# Altium schematic sheet Control.schdoc: EGB220_ControlBoard
size A3
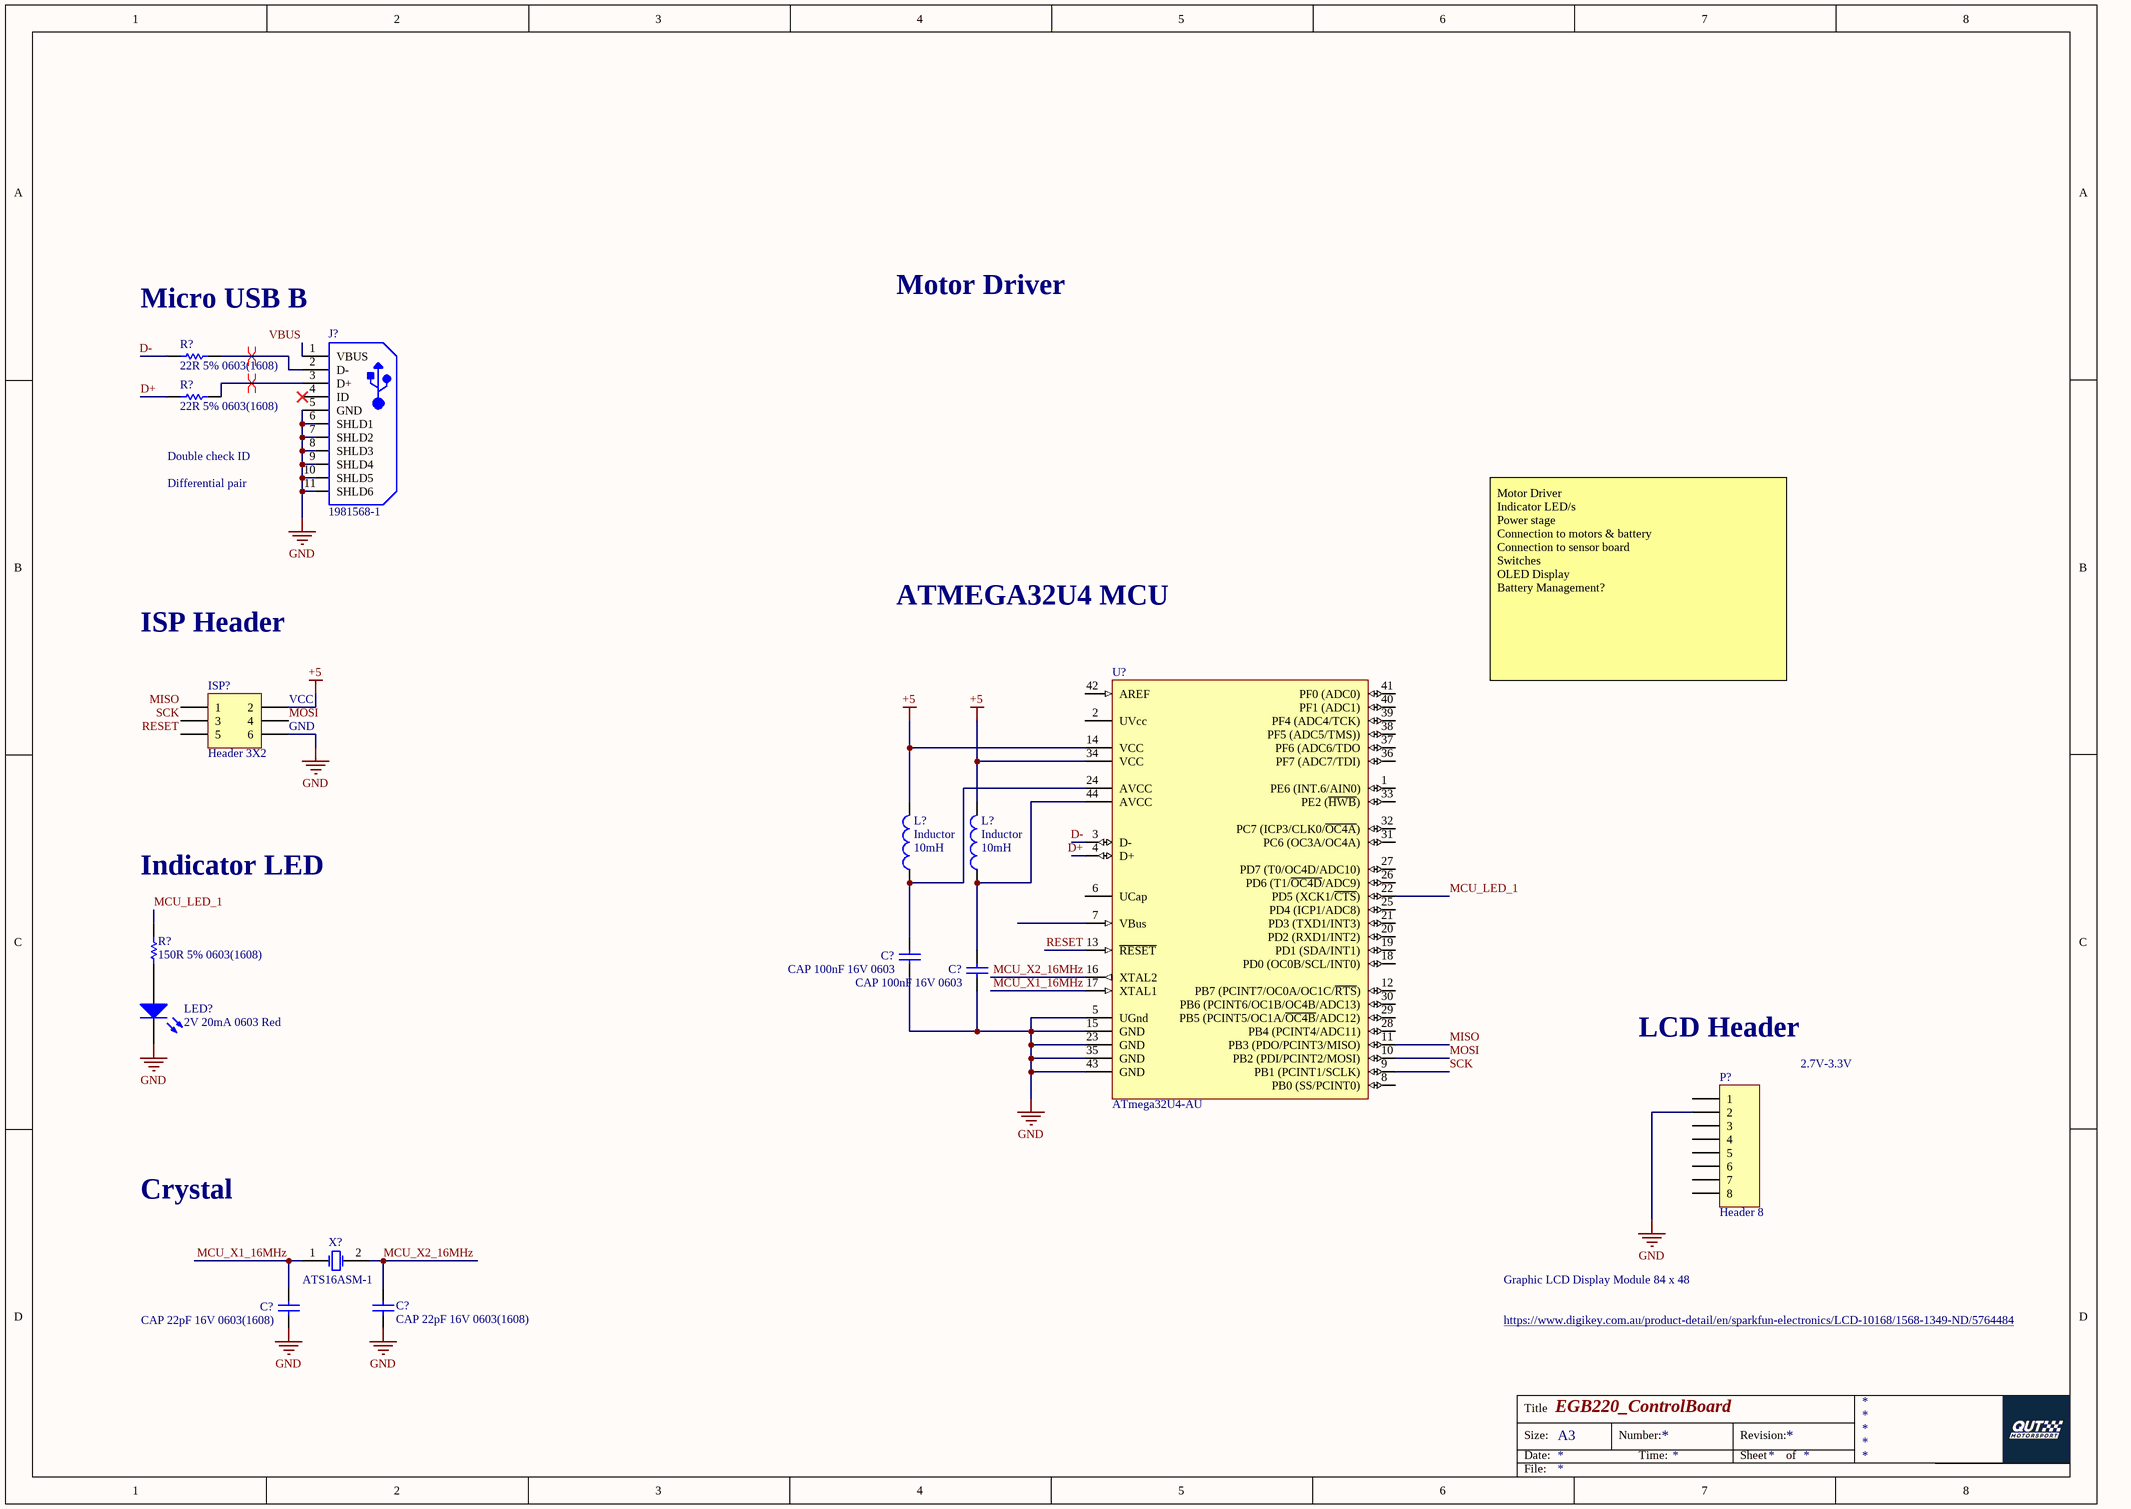
[diagram p0: Control.schdoc]

## Parts
(Parts that share a designator on the sheet are numbered #1, #2 ... from top to bottom, then left to right.)
C?#1  CAP 100nF 16V 0603  [CAPC0603(1608)100_M]
C?#2  CAP 100nF 16V 0603  [CAPC0603(1608)100_M]
C?#3  CAP 22pF 16V 0603(1608)  [CAPC0603(1608)100_N]
C?#4  CAP 22pF 16V 0603(1608)  [CAPC0603(1608)100_N]
ISP?  Header 3X2  [HDR2X3]
J?  1981568-1  [TECO-1981568-5_V]
L?#1  Inductor  value 10mH  [0603]
L?#2  Inductor  value 10mH  [0603]
LED?  2V 20mA 0603 Red  [0603_A]
P?  Header 8  [HDR1X8]
R?#1  22R 5% 0603(1608)  [RESC0603(1608)_N]
R?#2  22R 5% 0603(1608)  [RESC0603(1608)_N]
R?#3  150R 5% 0603(1608)  [RESC0603(1608)_L]
U?  ATmega32U4-AU  [44ML_M]
X?  ATS16ASM-1  [CTS-ATS-SM-XTAL-2]

## Nets
+5: ISP?.2 L?#1.2 L?#2.2 U?.14(VCC) U?.34(VCC)
GND: C?#1.1 C?#2.1 C?#3.2 C?#4.1 ISP?.6 J?.5(GND) J?.6(SHLD1) J?.7(SHLD2) J?.8(SHLD3) J?.9(SHLD4) J?.10(SHLD5) J?.11(SHLD6) LED?.1(K) P?.2 U?.5(UGnd) U?.15(GND) U?.23(GND) U?.35(GND) U?.43(GND)
D+: R?#2.1 U?.4(D+)
D-: R?#1.1 U?.3(D-)
MCU_LED_1: R?#3.2 U?.22(PD5_(XCK1/~{CTS}))
MCU_X1_16MHz: C?#4.2 U?.17(XTAL1) X?.1(X1)
MCU_X2_16MHz: C?#3.1 U?.16(XTAL2) X?.2(X2)
MISO: ISP?.1 U?.11(PB3_(PDO/PCINT3/MISO))
MOSI: ISP?.4 U?.10(PB2_(PDI/PCINT2/MOSI))
RESET: ISP?.5 U?.13(~{RESET})
SCK: ISP?.3 U?.9(PB1_(PCINT1/SCLK))
VBUS: J?.1(VBUS)
NetC?#1_2: C?#1.2 L?#1.1 U?.24(AVCC)
NetC?#2_2: C?#2.2 L?#2.1 U?.44(AVCC)
NetJ?_2: J?.2(D-) R?#1.2
NetJ?_3: J?.3(D+) R?#2.2
NetLED?_2: LED?.2(A) R?#3.1

Not connected (* = marked no-connect by the designer): J? 4(ID)*; P? 1 3 4 5 6 7 8; U? 1(PE6_(INT.6/AIN0)) 2(UVcc) 6(UCap) 7(VBus) 8(PB0_(SS/PCINT0)) 12(PB7_(PCINT7/OC0A/OC1C/~{RTS})) 18(PD0_(OC0B/SCL/INT0)) 19(PD1_(SDA/INT1)) 20(PD2_(RXD1/INT2)) 21(PD3_(TXD1/INT3)) 25(PD4_(ICP1/ADC8)) 26(PD6_(T1/~{OC4D}/ADC9)) 27(PD7_(T0/OC4D/ADC10)) 28(PB4_(PCINT4/ADC11)) 29(PB5_(PCINT5/OC1A/~{OC4B}/ADC12)) 30(PB6_(PCINT6/OC1B/OC4B/ADC13)) 31(PC6_(OC3A/OC4A)) 32(PC7_(ICP3/CLK0/~{OC4A})) 33(PE2_(~{HWB})) 36(PF7_(ADC7/TDI)) 37(PF6_(ADC6/TDO) 38(PF5_(ADC5/TMS))) 39(PF4_(ADC4/TCK)) 40(PF1_(ADC1)) 41(PF0_(ADC0)) 42(AREF)

## Layout directives
differential pair: NetJ?_2, NetJ?_3

## Notes on the sheet
- Micro USB B
- Motor Driver
- Double check ID
- Differential pair
- ISP Header
- ATMEGA32U4 MCU
- (near ISP?) VCC
- Motor Driver
  Indicator LED/s
  Power stage
  Connection to motors & battery
  Connection to sensor board
  Switches
  OLED Display
  Battery Management?
- (near ISP?) GND
- Indicator LED
- LCD Header
- 2.7V-3.3V
- Crystal
- Graphic LCD Display Module 84 x 48
- https://www.digikey.com.au/product-detail/en/sparkfun-electronics/LCD-10168/1568-1349-ND/5764484
- Title
- Size:
- Date:
- A3
- Number:
- Time:
- Revision:
- Sheet
- of
- File:

## Library data of the parts
C?#1 C?#2 = CMP-1035-02583-1: CAP 100nF 16V ±5% 0603 (1608 Metric) Thickness 1mm SMD; Tolerance: Â±5%; Case-Metric: 1608; Case-EIA: 0603; Rated Voltage: 16 V; Max Thickness: 1 mm; Technology: SMT; Value: 100nF
C?#3 C?#4 = CMP-1035-00808-1: CAP 22pF 16V ±5% 0603 (1608 Metric) Thickness 1mm SMD; Tolerance: Â±5%; Case-EIA: 0603; Case-Metric: 1608; Technology: SMT; Value: 22pF; Rated Voltage: 16 V; Max Thickness: 1 mm
ISP? = Header 3X2: Header, 3-Pin, Dual row; LatestRevisionDate: 17-Jul-2002; LatestRevisionNote: Re-released for DXP Platform.; Publisher: Altium Limited
J? = CMP-2000-05408-1: Micro USB Receptacle Standard Type B Assy, 5-Pin SMD, RoHS, Tape and Reel; Manufacturer: TE Connectivity; Body Orientation: RightAngle; Number of Ports: 1Port; Number of Contacts: 5POS; Gender: RCP; Voltage Rating Max: 30VAC; Product Depth (mm): 5.6mm; Pitch (mm): 0.65mm; Current Rating (Max): 1/ContactA; Product Length (mm): 8mm; Product Height (mm): 3mm; Operating Temperature Max Deg. C: 85C; Datasheet URL: http://www.mouser.com/ds/2/418/NG_CD_1981568_E2-621296.pdf; Termination Method: Solder; Number of Terminals: 5; Operating Temp Range: -55Cto85C; Mounting Style: SurfaceMount; Manufacturer URL: http://www.te.com/; Contact Material: CopperAlloy; Packaging: TapeandReel; Datasheet Version: Rev. E2, 08/2015; Operating Temperature Min Deg. C: -55C; Housing Material: Thermoplastic; Type: MicroUSB; Contact Plating: GoldOverNickel
L?#1 L?#2 = Inductor: Code_IEC: 1005; Published: 8-Jun-2000; LatestRevisionDate: 29-May-2009; LatestRevisionNote: IPC-7351 Footprint Added.; PackageReference: 0402-A; Publisher: Altium Limited; PackageDescription: Chip Inductor; Code_JEITA: 0402
LED? = CMP-1426-00001-1: SMD mono-color Chip LED, WL-SMCW, Red; Manufacturer: Wuerth Elektronik; PartNumber: 150060RS75000; Color: Red; PackageReference: 0603_A; ComponentLink2URL: http://katalog.we-online.com/led/datasheet/150060RS75000.pdf; ComponentLink1URL: http://www.we-online.com; ComponentLink1Description: Manufacturer URL; ComponentLink2Description: Datasheet
P? = Header 8: Header, 8-Pin; LatestRevisionDate: 17-Jul-2002; LatestRevisionNote: Re-released for DXP Platform.; Publisher: Altium Limited
R?#1 R?#2 = CMP-1012-00034-1: 22R 0.1W 5% 0603 (1608 Metric)  SMD; Value: 22.00 Ohm; Case-EIA: 0603; Case-Metric: 1608; Technology: SMT; Power: 0.1 W; Tolerance: 5 %
R?#3 = CMP-1012-00054-1: 150R 0.1W 5% 0603 (1608 Metric)  SMD; Case-EIA: 0603; Value: 150.00 Ohm; Case-Metric: 1608; Power: 0.1 W; Tolerance: 5 %; Technology: SMT
U? = CMP-0095-00285-2: 8-bit AVR Microcontroller, 2.7-5.5V, 16MHz, 32KB Flash, 1KB EEPROM, 2.5KB SRAM, USB Controller, 44-pin TQFP, Industrial Grade (-40°C to 85°C), Ext Osc; RevisionNote: DatasheetVersion updated. URLs added.; ComponentLink1Description: Manufacturer URL; PackageDescription: 44-Pin Plastic Thin Quad Flat Pack, 10 x 10 x 1.0 mm Body, 0.8 mm Pitch (TQFP); DatasheetVersion: revF, Nov-2010; ComponentLink2URL: http://www.atmel.com/dyn/resources/prod_documents/doc7766.pdf; ComponentLink1URL: http://www.atmel.com/; PackageReference: 44ML; ComponentLink2Description: ATmega16U4/32U4 Datasheet; PackageVersion: rev.G, Jul-2007; ComponentLink3URL: http://www.atmel.com/dyn/resources/prod_documents/7766S.pdf; ComponentLink3Description: ATmega16U4 ATmega32U4 Summary
X? = CMP-0585-00002-2: ATS-SM Series Quartz Crystal, 16 MHz, -20 to 70 degC, 11.1 x 4.83 x 4.3mm SMD, RoHS, Tape and Reel; Manufacturer: CTS Corporation; Shunt Capacitance (C0): 7.0 pF Max; Frequency: 16 MHz; Oscillation Mode: Fundamental or 3rd Overtone; Crystal Cut: AT-Cut; ESR Maximum: 40 Ohms; Drive Level (Type): 100 uW; PackageDescription: 2-Pin SMD, Body 11.1 x 4.83 mm, Pitch 8.5 mm; PackageReference: ATS-SM-XTAL-2; ComponentLink1URL: http://www.ctscorp.com/; PartNumber: ATS16ASM-1; RoHS: TRUE; ComponentLink1Description: Manufacturer URL; Operating Temperature: -20 to 70 degC; DatasheetVersion: Rev. K; ComponentLink2Description: Datasheet; Packing: Tape and Reel; ComponentLink2URL: http://www.ctscorp.com/components/Datasheets/008-0309-0.pdf; Mounting Technology: Surface Mount; ComponentLink3URL: http://www.ctscorp.com/components/Datasheets/008-0309-0.pdf; ComponentLink3Description: Package Specification